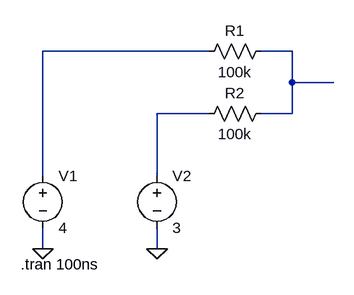
[diagram p0: schematic sumator_DC.asc]
sumator_DC.asc, the LTspice schematic file:
Version 4
SHEET 1 880 680
WIRE 304 -48 48 -48
WIRE 432 -48 384 -48
WIRE 432 0 432 -48
WIRE 496 0 432 0
WIRE 304 48 224 48
WIRE 432 48 432 0
WIRE 432 48 384 48
WIRE 48 144 48 -48
WIRE 224 144 224 48
WIRE 48 256 48 224
WIRE 224 256 224 224
FLAG 48 256 0
FLAG 224 256 0
SYMBOL voltage 48 128 R0
SYMATTR InstName V1
SYMATTR Value 4
SYMBOL voltage 224 128 R0
SYMATTR InstName V2
SYMATTR Value 3
SYMBOL res 400 -64 R90
WINDOW 0 0 56 VBottom 2
WINDOW 3 32 56 VTop 2
SYMATTR InstName R1
SYMATTR Value 100k
SYMBOL res 400 32 R90
WINDOW 0 0 56 VBottom 2
WINDOW 3 32 56 VTop 2
SYMATTR InstName R2
SYMATTR Value 100k
TEXT 14 280 Left 2 !.tran 100ns

The netlist it stands for:
* sumator_DC.asc
V1 N001 0 4
V2 N003 0 3
R1 N002 N001 100k
R2 N002 N003 100k
.tran 100ns
.backanno
.end